# Altium project LCR_project.PrjPcb
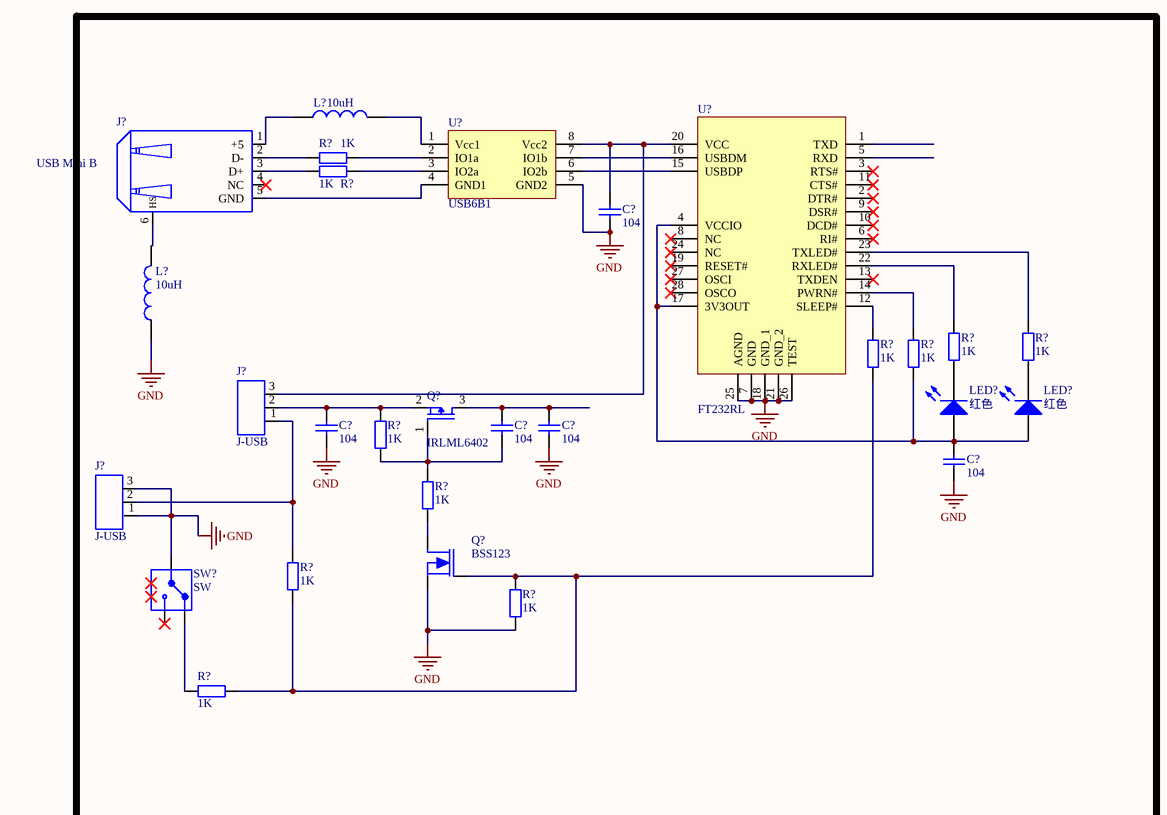
[diagram p0: 原理图.SchDoc, top left]
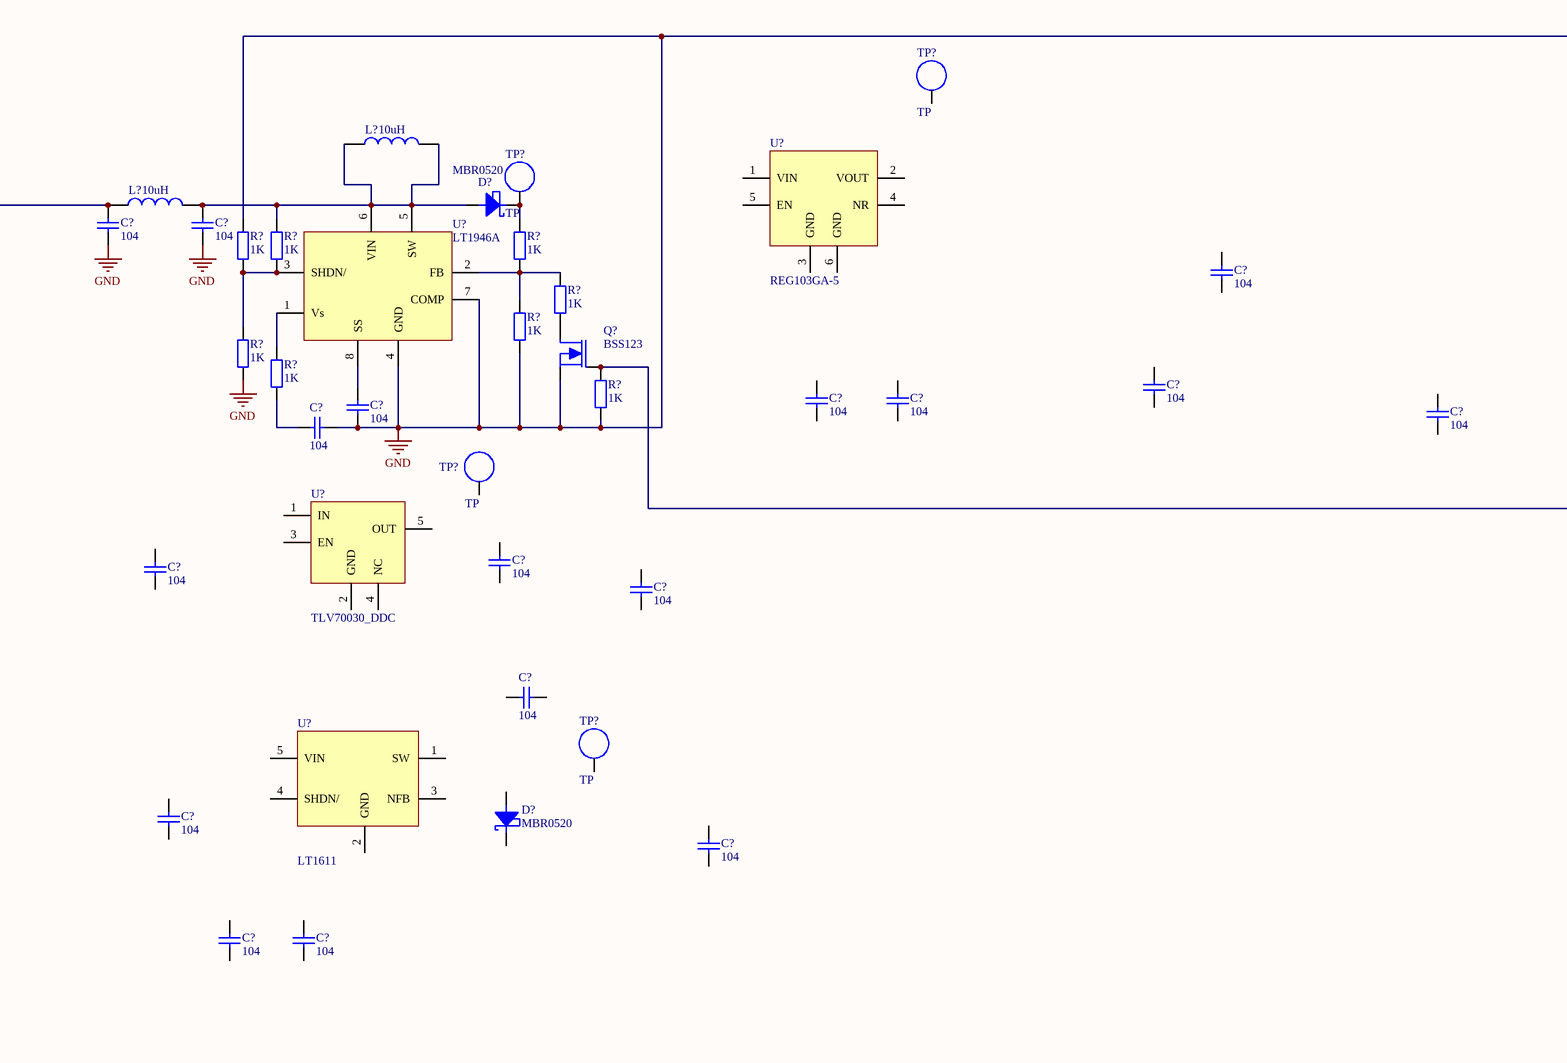
[diagram p1: 原理图.SchDoc, top middle]
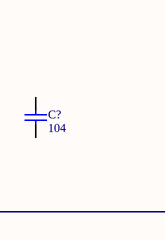
[diagram p2: 原理图.SchDoc, top right]
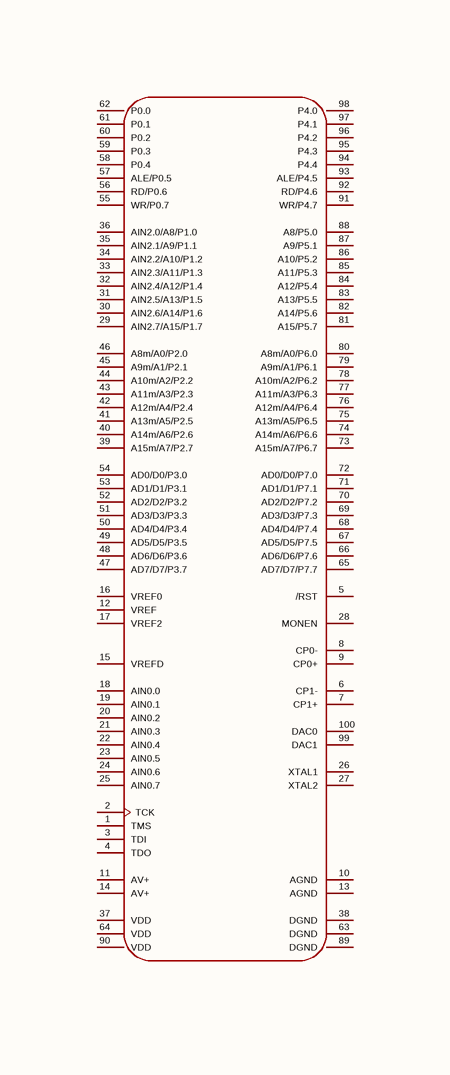
[diagram p3: 原理图.SchDoc, centre right]
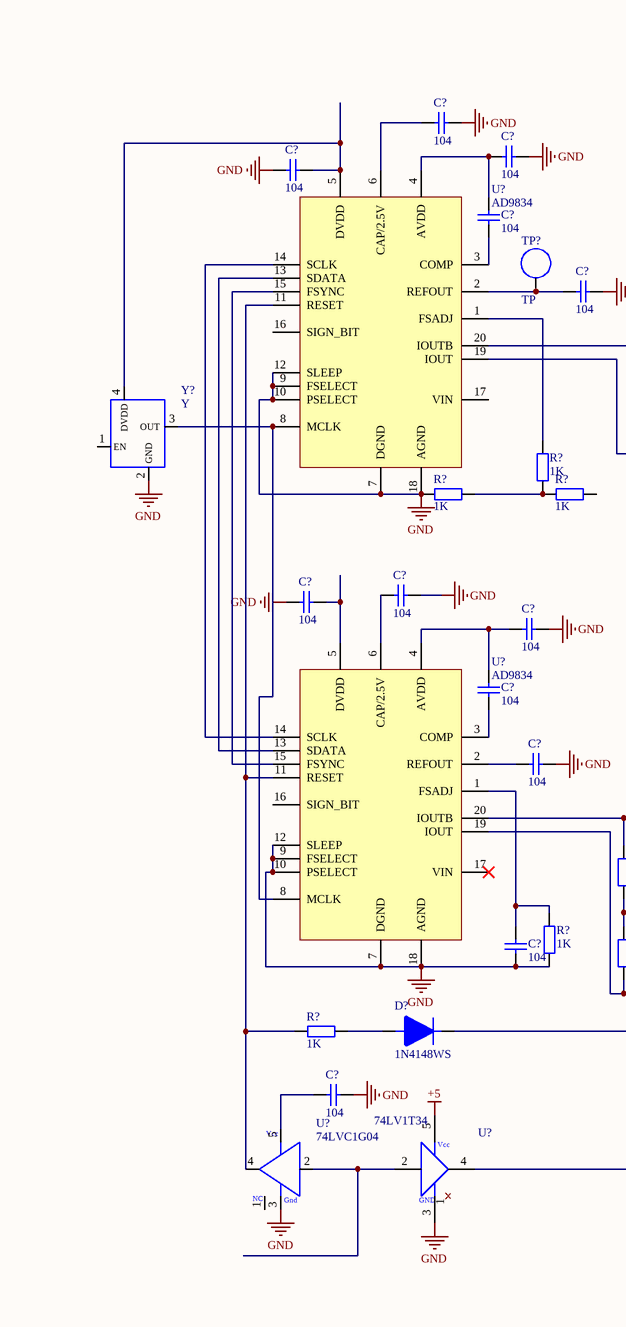
[diagram p4: 原理图.SchDoc, bottom left]
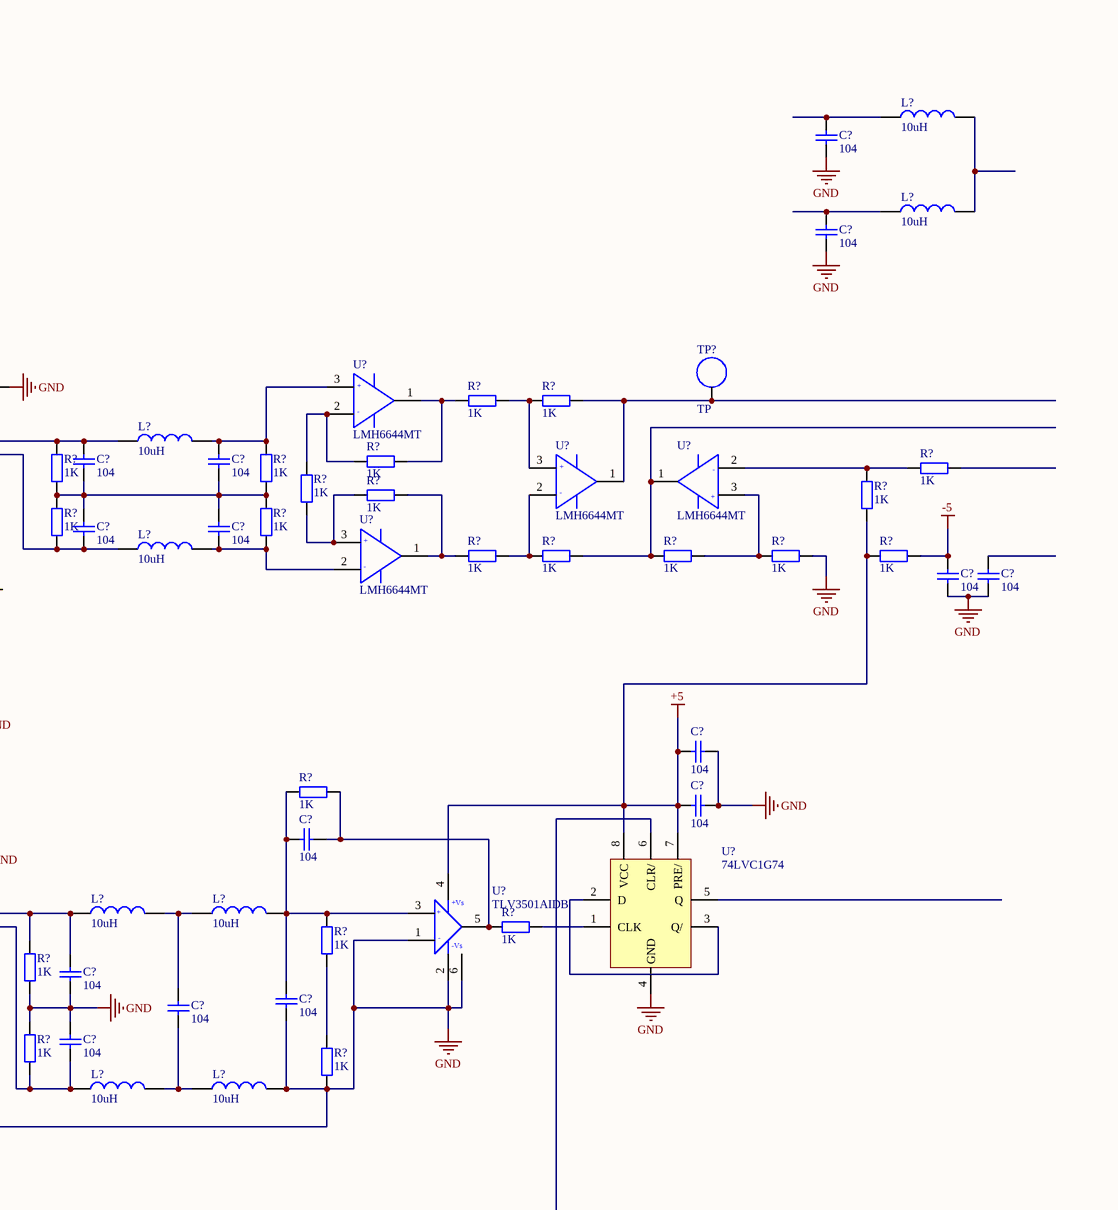
[diagram p5: 原理图.SchDoc, bottom middle]
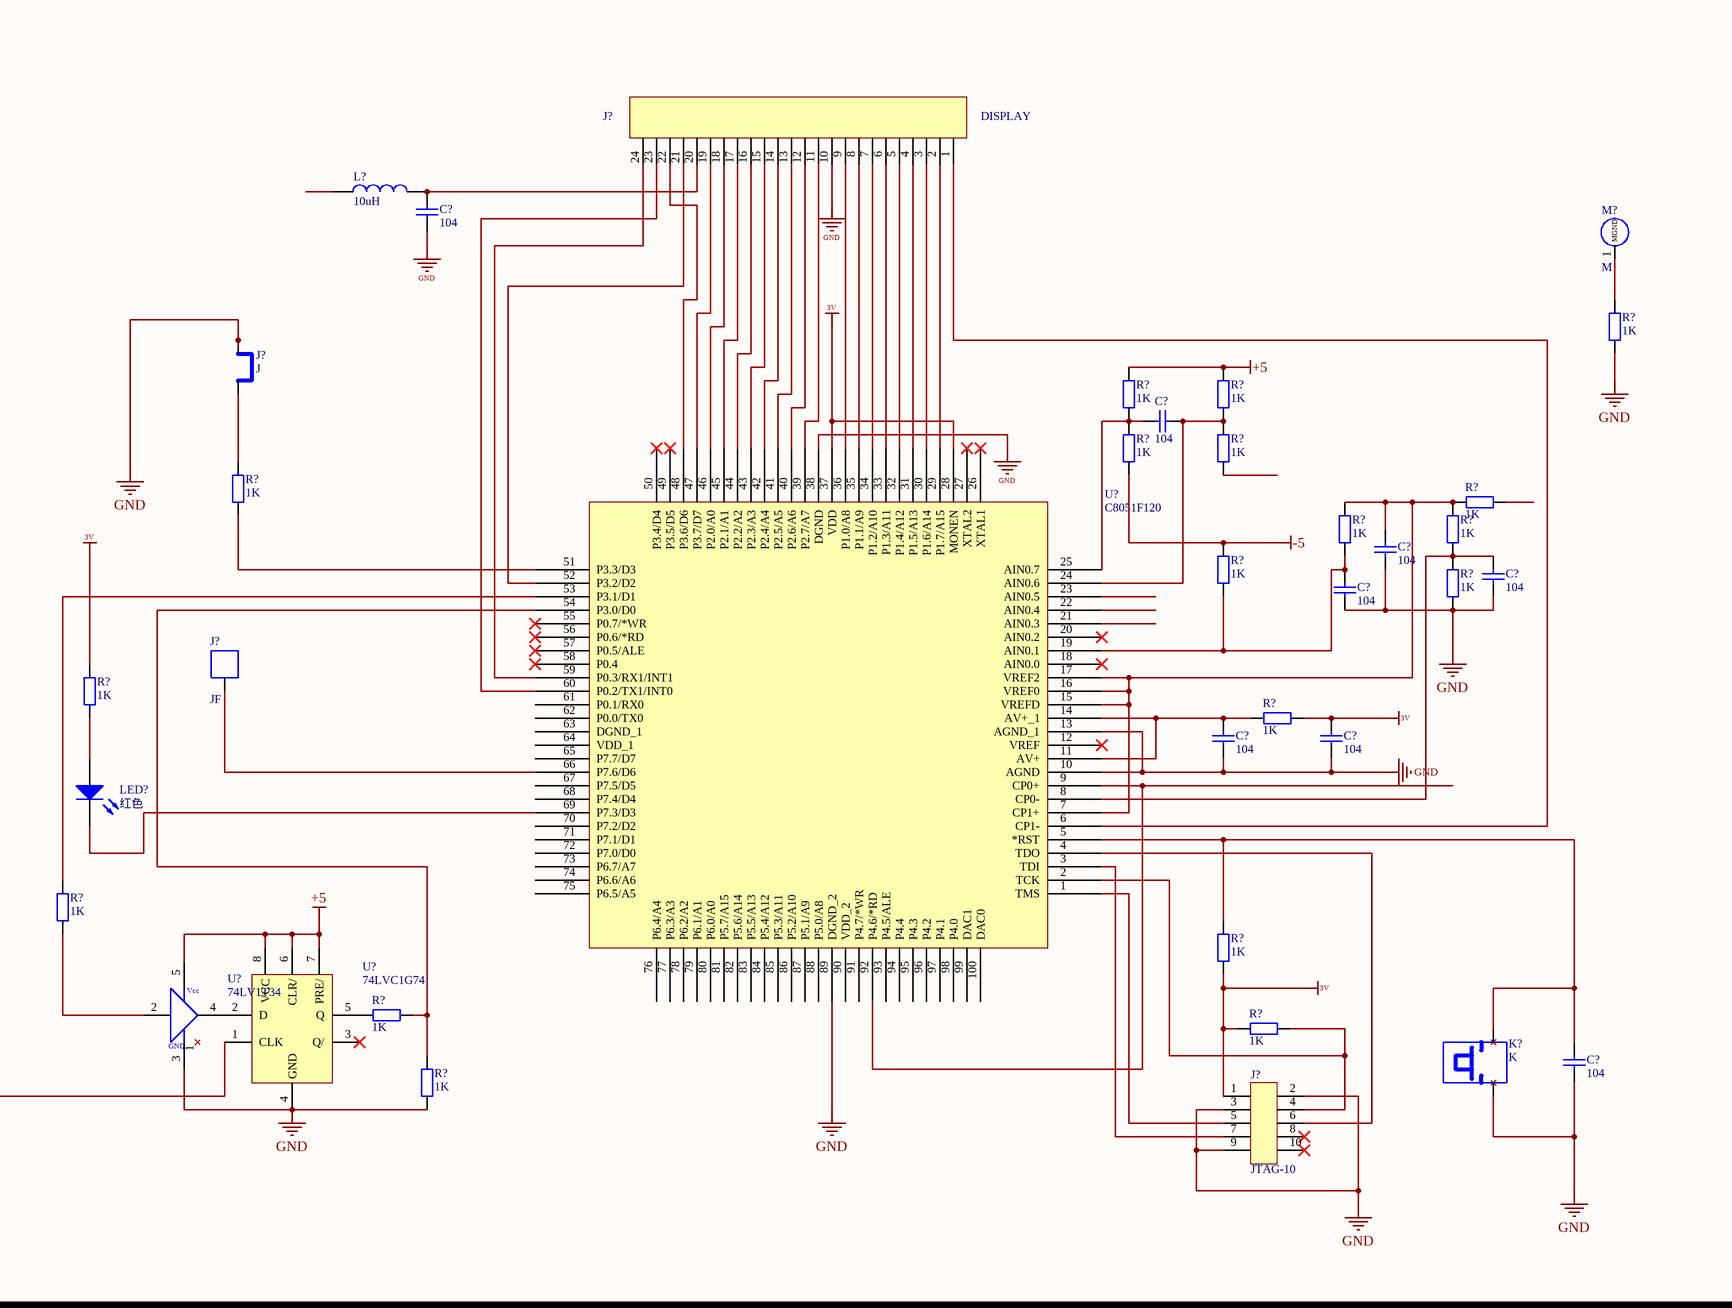
[diagram p6: 原理图.SchDoc, bottom right]
1 sheet, 181 parts. Net scope: global (net labels, ports and power ports of the same name join across sheets).
Board file: LCR_PCB.PcbDoc

## Sheet 原理图.SchDoc
size 1499 x 1499 mm

### Parts
(Parts that share a designator on the sheet are numbered #1, #2 ... from top to bottom, then left to right.)
C?#1  104  [C0603_L]
C?#2  104  [C0603_L]
C?#3  104  [C0603_L]
C?#4  104  [C0603_L]
C?#5  104  [C0603_L]
C?#6  104  [C0603_L]
C?#7  104  [C0603_L]
C?#8  104  [C0603_L]
C?#9  104  [C0603_L]
C?#10  104  [C0603_L]
C?#11  104  [C0603_L]
C?#12  104  [C0603_L]
C?#13  104  [C0603_L]
C?#14  104  [C0603_L]
C?#15  104  [C0603_L]
C?#16  104  [C0603_L]
C?#17  104  [C0603_L]
C?#18  104  [C0603_L]
C?#19  104  [C0603_L]
C?#20  104  [C0603_L]
C?#21  104  [C0603_L]
C?#22  104  [C0603_L]
C?#23  104  [C0603_L]
C?#24  104  [C0603_L]
C?#25  104  [C0603_L]
C?#26  104  [C0603_L]
C?#27  104  [C0603_L]
C?#28  104  [C0603_L]
C?#29  104  [C0603_L]
C?#30  104  [C0603_L]
C?#31  104  [C0603_L]
C?#32  104  [C0603_L]
C?#33  104  [C0603_L]
C?#34  104  [C0603_L]
C?#35  104  [C0603_L]
C?#36  104  [C0603_L]
C?#37  104  [C0603_L]
C?#38  104  [C0603_L]
C?#39  104  [C0603_L]
C?#40  104  [C0603_L]
C?#41  104  [C0603_L]
C?#42  104  [C0603_L]
C?#43  104  [C0603_L]
C?#44  104  [C0603_L]
C?#45  104  [C0603_L]
C?#46  104  [C0603_L]
C?#47  104  [C0603_L]
C?#48  104  [C0603_L]
C?#49  104  [C0603_L]
C?#50  104  [C0603_L]
C?#51  104  [C0603_L]
C?#52  104  [C0603_L]
C?#53  104  [C0603_L]
C?#54  104  [C0603_L]
C?#55  104  [C0603_L]
C?#56  104  [C0603_L]
C?#57  104  [C0603_L]
C?#58  104  [C0603_L]
D?#1  MBR0520
D?#2  MBR0520
D?#3  1N4148WS
J?#1  USB Mini B
J?#2  J-USB
J?#3  J-USB
J?#4  DISPLAY
J?#5  J
J?#6  JF
J?#7  JTAG-10
K?  K
L?#1  10uH  [L0603]
L?#2  10uH  [L0603]
L?#3  10uH  [L0603]
L?#4  10uH  [L0603]
L?#5  10uH  [L0603]
L?#6  10uH  [L0603]
L?#7  10uH  [L0603]
L?#8  10uH  [L0603]
L?#9  10uH  [L0603]
L?#10  10uH  [L0603]
L?#11  10uH  [L0603]
L?#12  10uH  [L0603]
L?#13  10uH  [L0603]
LED?#1  红色  [LED0805_G]
LED?#2  红色  [LED0805_G]
LED?#3  红色  [LED 8MM-B]
M?  M
Q?#1  BSS123
Q?#2  IRLML6402
Q?#3  BSS123
R?#1  1K  [R0603_L]
R?#2  1K  [R0603_L]
R?#3  1K  [R0603_L]
R?#4  1K  [R0603_L]
R?#5  1K  [R0603_L]
R?#6  1K  [R0603_L]
R?#7  1K  [R0603_L]
R?#8  1K  [R0603_L]
R?#9  1K  [R0603_L]
R?#10  1K  [R0603_L]
R?#11  1K  [R0603_L]
R?#12  1K  [R0603_L]
R?#13  1K  [R0603_L]
R?#14  1K  [R0603_L]
R?#15  1K  [R0603_L]
R?#16  1K  [R0603_L]
R?#17  1K  [R0603_L]
R?#18  1K  [R0603_L]
R?#19  1K  [R0603_L]
R?#20  1K  [R0603_L]
R?#21  1K  [R0603_L]
R?#22  1K  [R0603_L]
R?#23  1K  [R0603_L]
R?#24  1K  [R0603_L]
R?#25  1K  [R0603_L]
R?#26  1K  [R0603_L]
R?#27  1K  [R0603_L]
R?#28  1K  [R0603_L]
R?#29  1K  [R0603_L]
R?#30  1K  [R0603_L]
R?#31  1K  [R0603_L]
R?#32  1K  [R0603_L]
R?#33  1K  [R0603_L]
R?#34  1K  [R0603_L]
R?#35  1K  [R0603_L]
R?#36  1K  [R0603_L]
R?#37  1K  [R0603_L]
R?#38  1K  [R0603_L]
R?#39  1K  [R0603_L]
R?#40  1K  [R0603_L]
R?#41  1K  [R0603_L]
R?#42  1K  [R0603_L]
R?#43  1K  [R0603_L]
R?#44  1K  [R0603_L]
R?#45  1K  [R0603_L]
R?#46  1K  [R0603_L]
R?#47  1K  [R0603_L]
R?#48  1K  [R0603_L]
R?#49  1K  [R0603_L]
R?#50  1K  [R0603_L]
R?#51  1K  [R0603_L]
R?#52  1K  [R0603_L]
R?#53  1K  [R0603_L]
R?#54  1K  [R0603_L]
R?#55  1K  [R0603_L]
R?#56  1K  [R0603_L]
R?#57  1K  [R0603_L]
R?#58  1K  [R0603_L]
R?#59  1K  [R0603_L]
R?#60  1K  [R0603_L]
R?#61  1K  [R0603_L]
R?#62  1K  [R0603_L]
R?#63  1K  [R0603_L]
R?#64  1K  [R0603_L]
SW?  SW
TP?#1  TP
TP?#2  TP
TP?#3  TP
TP?#4  TP
TP?#5  TP
TP?#6  TP
U?#1  REG103GA-5
U?#2  LT1946A
U?#3  USB6B1
U?#4  FT232RL
U?#5  TLV70030_DDC
U?#6  LT1611
U?#7  C8051F120-GQR  (value not drawn)
U?#8  LMH6644MT
U?#9  C8051F120
U?#10  AD9834
U?#11  LMH6644MT
U?#12  LMH6644MT
U?#13  LMH6644MT
U?#14  74LVC1G74
U?#15  AD9834
U?#16  TLV3501AIDB
U?#17  74LVC1G74
U?#18  74LV1T34
U?#19  74LVC1G04
U?#20  74LV1T34
Y?  Y

### Nets
3V: C?#46.1 J?#7.1 R?#50.2 R?#51.1 R?#57.1 R?#61.2 U?#9.28(MONEN) U?#9.37(VDD)
+5: C?#47.1 C?#49.1 R?#23.2 R?#24.2 R?#26.2 R?#42.2 U?#14.7(PRE/) U?#14.8(VCC) U?#16.4 U?#17.6(CLR/) U?#17.7(PRE/) U?#17.8(VCC) U?#18.5 U?#20.5
-5: C?#39.2 R?#28.1 R?#42.1 R?#48.2
GND: C?#1.1 C?#2.1 C?#7.1 C?#10.1 C?#11.1 C?#16.1 C?#18.1 C?#19.1 C?#24.2 C?#25.2 C?#26.2 C?#27.2 C?#28.2 C?#29.1 C?#31.2 C?#37.2 C?#38.2 C?#39.1 C?#40.1 C?#41.2 C?#42.2 C?#43.1 C?#44.2 C?#45.2 C?#46.2 C?#47.2 C?#49.2 C?#51.2 C?#52.2 C?#53.2 C?#55.2 C?#56.1 C?#57.2 C?#58.2 D?#3.2 J?#3.1 J?#3.3 J?#4.10 J?#5.1 J?#7.2 J?#7.3 J?#7.9 K?.2 L?#4.1 L?#13.2 Q?#1.2 Q?#3.2 R?#1.1 R?#5.2 R?#6.2 R?#8.2 R?#18.2 R?#20.1 R?#41.1 R?#45.2 R?#49.1 R?#56.2 R?#58.2 R?#60.1 R?#62.2 R?#63.1 SW?.3 U?#2.4(GND) U?#2.7(COMP) U?#3.5(GND2) U?#4.7(GND) U?#4.18(GND_1) U?#4.21(GND_2) U?#4.25(AGND) U?#4.26(TEST) U?#9.10(AGND) U?#9.13(AGND_1) U?#9.38(DGND) U?#9.89(DGND_2) U?#10.7(DGND) U?#10.9(FSELECT) U?#10.10(PSELECT) U?#10.12(SLEEP) U?#10.18(AGND) U?#14.4(GND) U?#15.7(DGND) U?#15.9(FSELECT) U?#15.10(PSELECT) U?#15.12(SLEEP) U?#15.18(AGND) U?#16.1 U?#16.2 U?#16.6 U?#17.4(GND) U?#18.3 U?#19.3 U?#20.3 Y?.2(GND)
NetC?#1_2: C?#1.2 L?#2.1
NetC?#2_2: C?#2.2 D?#1.1 L?#1.1 L?#1.2 L?#2.2 R?#2.1 U?#2.5(SW) U?#2.6(VIN)
NetC?#7_2: C?#7.2 U?#2.8(SS)
NetC?#10_2: C?#10.2 R?#7.2
NetC?#11_2: C?#11.2 J?#2.3 U?#3.8(Vcc2) U?#4.20(VCC)
NetC?#16_2: C?#16.2 J?#2.2 Q?#2.2 R?#15.1
NetC?#17_1: C?#17.1 Q?#2.1 R?#15.2 R?#16.1
NetC?#17_2: C?#17.2 C?#18.2 Q?#2.3
NetC?#19_2: C?#19.2 LED?#1.1(A) LED?#2.1(A) R?#14.2 U?#4.4(VCCIO) U?#4.17(3V3OUT)
NetC?#24_1: C?#24.1 L?#5.1
NetC?#25_1: C?#25.1 J?#4.20 L?#6.2
NetC?#26_1: C?#26.1 U?#10.6(CAP/2.5V)
NetC?#27_1: C?#27.1 L?#7.1
NetC?#28_1: C?#28.1 C?#30.1 U?#10.4(AVDD)
NetC?#29_2: C?#29.2 U?#10.5(DVDD) Y?.4(DVDD)
NetC?#30_2: C?#30.2 U?#10.3(COMP)
NetC?#31_1: C?#31.1 TP?#5.1 U?#10.2(REFOUT)
NetC?#32_1: C?#32.1 R?#23.1 R?#28.2 U?#9.25(AIN0.7)
NetC?#32_2: C?#32.2 R?#24.1 R?#29.2 U?#9.24(AIN0.6)
NetC?#33_1: C?#33.1 L?#8.1 R?#30.2 U?#10.20(IOUTB)
NetC?#33_2: C?#33.2 C?#34.2 C?#35.1 C?#36.1 R?#30.1 R?#31.1 R?#36.2 R?#37.2
NetC?#34_1: C?#34.1 L?#8.2 R?#31.2 U?#8.3
NetC?#35_2: C?#35.2 L?#9.1 R?#36.1 U?#10.19(IOUT)
NetC?#36_2: C?#36.2 L?#9.2 R?#37.1 U?#13.2
NetC?#37_1: C?#37.1 R?#33.2 R?#43.2 R?#44.2 U?#9.7(CP1+) U?#9.15(VREFD) U?#9.16(VREF0) U?#9.17(VREF2)
NetC?#38_1: C?#38.1 R?#44.1 R?#49.2 U?#9.8(CP0-)
NetC?#41_1: C?#41.1 R?#43.1 R?#48.1 U?#9.19(AIN0.1)
NetC?#42_1: C?#42.1 U?#15.6(CAP/2.5V)
NetC?#43_2: C?#43.2 U?#15.5(DVDD)
NetC?#44_1: C?#44.1 C?#48.1 U?#15.4(AVDD)
NetC?#45_1: C?#45.1 R?#51.2 U?#9.11(AV+) U?#9.14(AV+_1)
NetC?#48_2: C?#48.2 U?#15.3(COMP)
NetC?#50_1: C?#50.1 C?#53.1 L?#11.2 R?#52.2 R?#53.1 U?#16.3
NetC?#50_2: C?#50.2 R?#52.1 R?#54.2 U?#16.5
NetC?#51_1: C?#51.1 U?#15.2(REFOUT)
NetC?#52_1: C?#52.1 L?#10.1 R?#56.1 U?#15.20(IOUTB)
NetC?#54_1: C?#54.1 L?#10.2 L?#11.1
NetC?#54_2: C?#54.2 L?#12.2 L?#13.1
NetC?#55_1: C?#55.1 R?#58.1 U?#15.1(FSADJ)
NetC?#56_2: C?#56.2 L?#12.1 R?#60.2 U?#15.19(IOUT)
NetC?#57_1: C?#57.1 K?.1 R?#57.2 U?#9.5(*RST)
NetC?#58_1: C?#58.1 U?#19.5
NetD?#1_2: D?#1.2 R?#3.1 TP?#2.1
NetD?#3_1: D?#3.1 R?#64.1
NetJ?#1_1: J?#1.1(+5) L?#3.1
NetJ?#1_2: J?#1.2(D-) R?#9.2
NetJ?#1_3: J?#1.3(D+) R?#10.2
NetJ?#1_5: J?#1.5(GND) U?#3.4(GND1)
NetJ?#1_6: J?#1.6(HS) L?#4.2
NetJ?#2_1: J?#2.1 J?#3.2 R?#17.1
NetJ?#4_1: J?#4.1 U?#9.6(CP1-)
NetJ?#4_2: J?#4.2 U?#9.29(P1.7/A15)
NetJ?#4_3: J?#4.3 U?#9.30(P1.6/A14)
NetJ?#4_4: J?#4.4 U?#9.31(P1.5/A13)
NetJ?#4_5: J?#4.5 U?#9.32(P1.4/A12)
NetJ?#4_6: J?#4.6 U?#9.33(P1.3/A11)
NetJ?#4_7: J?#4.7 U?#9.34(P1.2/A10)
NetJ?#4_8: J?#4.8 U?#9.35(P1.1/A9)
NetJ?#4_9: J?#4.9 U?#9.36(P1.0/A8)
NetJ?#4_11: J?#4.11 U?#9.39(P2.7/A7)
NetJ?#4_12: J?#4.12 U?#9.40(P2.6/A6)
NetJ?#4_13: J?#4.13 U?#9.41(P2.5/A5)
NetJ?#4_14: J?#4.14 U?#9.42(P2.4/A4)
NetJ?#4_15: J?#4.15 U?#9.43(P2.3/A3)
NetJ?#4_16: J?#4.16 U?#9.44(P2.2/A2)
NetJ?#4_17: J?#4.17 U?#9.45(P2.1/A1)
NetJ?#4_18: J?#4.18 U?#9.46(P2.0/A0)
NetJ?#4_19: J?#4.19 U?#9.47(P3.7/D7)
NetJ?#4_21: J?#4.21 U?#9.52(P3.2/D2)
NetJ?#4_22: J?#4.22 U?#9.48(P3.6/D6)
NetJ?#4_23: J?#4.23 U?#9.60(P0.2/TX1/INT0)
NetJ?#4_24: J?#4.24 U?#9.59(P0.3/RX1/INT1)
NetJ?#5_2: J?#5.2 R?#35.2
NetJ?#6_1: J?#6.1 U?#9.66(P7.6/D6)
NetJ?#7_4: J?#7.4 R?#61.1 U?#9.2(TCK)
NetJ?#7_5: J?#7.5 U?#9.1(TMS)
NetJ?#7_6: J?#7.6 U?#9.4(TDO)
NetJ?#7_7: J?#7.7 U?#9.3(TDI)
NetL?#3_2: L?#3.2 U?#3.1(Vcc1)
NetL?#5_2: L?#5.2 L?#7.2
NetLED?#1_2: LED?#1.2(K) R?#11.2
NetLED?#2_2: LED?#2.2(K) R?#12.2
NetLED?#3_1: LED?#3.1(A) R?#50.1
NetLED?#3_2: LED?#3.2(K) U?#9.69(P7.3/D3)
NetM?_1: M?.1(MGND) R?#20.2
NetQ?#1_1: Q?#1.1 R?#4.2
NetQ?#1_3: Q?#1.3 R?#8.1
NetQ?#3_1: Q?#3.1 R?#16.2
NetQ?#3_3: Q?#3.3 R?#13.2 R?#17.2 R?#18.1 R?#19.1
NetR?#1_2: R?#1.2 R?#2.2 R?#6.1 U?#2.3(SHDN/)
NetR?#3_2: R?#3.2 R?#4.1 R?#5.1 U?#2.2(FB)
NetR?#7_1: R?#7.1 U?#2.1(Vs)
NetR?#9_1: R?#9.1 U?#3.2(IO1a)
NetR?#10_1: R?#10.1 U?#3.3(IO2a)
NetR?#11_1: R?#11.1 U?#4.22(RXLED#)
NetR?#12_1: R?#12.1 U?#4.23(TXLED#)
NetR?#13_1: R?#13.1 U?#4.12(SLEEP#)
NetR?#14_1: R?#14.1 U?#4.14(PWRN#)
NetR?#19_2: R?#19.2 SW?.1
NetR?#21_1: R?#21.1 R?#22.2 U?#11.3
NetR?#21_2: R?#21.2 R?#25.1 U?#8.1
NetR?#22_1: R?#22.1 TP?#6.1 U?#11.1
NetR?#25_2: R?#25.2 R?#34.2 U?#8.2
NetR?#26_1: R?#26.1 R?#27.2 U?#12.2
NetR?#32_1: R?#32.1 R?#38.2 U?#13.1
NetR?#32_2: R?#32.2 R?#34.1 U?#13.3
NetR?#35_1: R?#35.1 U?#9.51(P3.3/D3)
NetR?#38_1: R?#38.1 R?#39.2 U?#11.2
NetR?#39_1: R?#39.1 R?#40.2 U?#12.1
NetR?#40_1: R?#40.1 R?#41.2 U?#12.3
NetR?#45_1: R?#45.1 R?#46.1 R?#47.2
NetR?#46_2: R?#46.2 U?#10.1(FSADJ)
NetR?#53_2: R?#53.2 R?#62.1
NetR?#54_1: R?#54.1 U?#14.1(CLK)
NetR?#55_1: R?#55.1 U?#18.2
NetR?#55_2: R?#55.2 U?#9.53(P3.1/D1)
NetR?#59_1: R?#59.1 R?#63.2 U?#9.54(P3.0/D0)
NetR?#59_2: R?#59.2 U?#17.5(Q)
NetR?#64_2: R?#64.2 U?#10.11(RESET) U?#15.11(RESET) U?#19.4
NetU?#3_6: U?#3.6(IO2b) U?#4.15(USBDP)
NetU?#3_7: U?#3.7(IO1b) U?#4.16(USBDM)
NetU?#9_9: U?#9.9(CP0+) U?#9.92(P4.6/*RD)
NetU?#10_8: U?#10.8(MCLK) U?#15.8(MCLK) Y?.3(OUT)
NetU?#10_13: U?#10.13(SDATA) U?#15.13(SDATA)
NetU?#10_14: U?#10.14(SCLK) U?#15.14(SCLK)
NetU?#10_15: U?#10.15(FSYNC) U?#15.15(FSYNC)
NetU?#14_2: U?#14.2(D) U?#14.3(Q/)
NetU?#14_6: U?#14.6(CLR/) U?#20.4
NetU?#17_2: U?#17.2(D) U?#18.4
NetU?#19_2: U?#19.2 U?#20.2

Not connected (* = marked no-connect by the designer): C?#3 1 2; C?#4 1 2; C?#5 1 2; C?#6 1 2; C?#8 1 2; C?#9 1 2; C?#12 1 2; C?#13 1 2; C?#14 1 2; C?#15 1 2; C?#20 1 2; C?#21 1 2; C?#22 1 2; C?#23 1 2; C?#40 2; D?#2 1 2; J?#1 4(NC)*; J?#7 8* 10*; L?#6 1; R?#27 1; R?#29 1; R?#33 1; R?#47 1; SW? 0* 2*; TP?#1 1; TP?#3 1; TP?#4 1; U?#1 1(VIN) 2(VOUT) 3(GND) 4(NR) 5(EN) 6(GND); U?#4 1(TXD) 2(DTR#)* 3(RTS#)* 5(RXD) 6(RI#)* 8(NC)* 9(DSR#)* 10(DCD#)* 11(CTS#)* 13(TXDEN)* 19(RESET#)* 24(NC)* 27(OSCI)* 28(OSCO)*; U?#5 1(IN) 2(GND) 3(EN) 4(NC) 5(OUT); U?#6 1(SW) 2(GND) 3(NFB) 4(SHDN/) 5(VIN); U?#7 1(TMS) 2(TCK) 3(TDI) 4(TDO) 5(/RST) 6(CP1-) 7(CP1+) 8(CP0-) 9(CP0+) 10(AGND) 11(AV+) 12(VREF) 13(AGND) 14(AV+) 15(VREFD) 16(VREF0) 17(VREF2) 18(AIN0.0) 19(AIN0.1) 20(AIN0.2) 21(AIN0.3) 22(AIN0.4) 23(AIN0.5) 24(AIN0.6) 25(AIN0.7) 26(XTAL1) 27(XTAL2) 28(MONEN) 29(AIN2.7/A15/P1.7) 30(AIN2.6/A14/P1.6) 31(AIN2.5/A13/P1.5) 32(AIN2.4/A12/P1.4) 33(AIN2.3/A11/P1.3) 34(AIN2.2/A10/P1.2) 35(AIN2.1/A9/P1.1) 36(AIN2.0/A8/P1.0) 37(VDD) 38(DGND) 39(A15m/A7/P2.7) 40(A14m/A6/P2.6) 41(A13m/A5/P2.5) 42(A12m/A4/P2.4) 43(A11m/A3/P2.3) 44(A10m/A2/P2.2) 45(A9m/A1/P2.1) 46(A8m/A0/P2.0) 47(AD7/D7/P3.7) 48(AD6/D6/P3.6) 49(AD5/D5/P3.5) 50(AD4/D4/P3.4) 51(AD3/D3/P3.3) 52(AD2/D2/P3.2) 53(AD1/D1/P3.1) 54(AD0/D0/P3.0) 55(WR/P0.7) 56(RD/P0.6) 57(ALE/P0.5) 58(P0.4) 59(P0.3) 60(P0.2) 61(P0.1) 62(P0.0) 63(DGND) 64(VDD) 65(AD7/D7/P7.7) 66(AD6/D6/P7.6) 67(AD5/D5/P7.5) 68(AD4/D4/P7.4) 69(AD3/D3/P7.3) 70(AD2/D2/P7.2) 71(AD1/D1/P7.1) 72(AD0/D0/P7.0) 73(A15m/A7/P6.7) 74(A14m/A6/P6.6) 75(A13m/A5/P6.5) 76(A12m/A4/P6.4) 77(A11m/A3/P6.3) 78(A10m/A2/P6.2) 79(A9m/A1/P6.1) 80(A8m/A0/P6.0) 81(A15/P5.7) 82(A14/P5.6) 83(A13/P5.5) 84(A12/P5.4) 85(A11/P5.3) 86(A10/P5.2) 87(A9/P5.1) 88(A8/P5.0) 89(DGND) 90(VDD) 91(WR/P4.7) 92(RD/P4.6) 93(ALE/P4.5) 94(P4.4) 95(P4.3) 96(P4.2) 97(P4.1) 98(P4.0) 99(DAC1) 100(DAC0); U?#9 12(VREF)* 18(AIN0.0)* 20(AIN0.2)* 21(AIN0.3) 22(AIN0.4) 23(AIN0.5) 26(XTAL1)* 27(XTAL2)* 49(P3.5/D5)* 50(P3.4/D4)* 55(P0.7/*WR)* 56(P0.6/*RD)* 57(P0.5/ALE)* 58(P0.4)* 61(P0.1/RX0) 62(P0.0/TX0) 63(DGND_1) 64(VDD_1) 65(P7.7/D7) 67(P7.5/D5) 68(P7.4/D4) 70(P7.2/D2) 71(P7.1/D1) 72(P7.0/D0) 73(P6.7/A7) 74(P6.6/A6) 75(P6.5/A5) 76(P6.4/A4) 77(P6.3/A3) 78(P6.2/A2) 79(P6.1/A1) 80(P6.0/A0) 81(P5.7/A15) 82(P5.6/A14) 83(P5.5/A13) 84(P5.4/A12) 85(P5.3/A11) 86(P5.2/A10) 87(P5.1/A9) 88(P5.0/A8) 90(VDD_2) 91(P4.7/*WR) 93(P4.5/ALE) 94(P4.4) 95(P4.3) 96(P4.2) 97(P4.1) 98(P4.0) 99(DAC1) 100(DAC0); U?#10 16(SIGN_BIT) 17(VIN); U?#14 5(Q); U?#15 16(SIGN_BIT) 17(VIN)*; U?#17 1(CLK) 3(Q/)*; U?#18 1; U?#19 1; U?#20 1; Y? 1(EN)

### Notes on the sheet
- Title
- Size:
- Date:
- File:
- A0
- Number:
- Time:
- Revision:
- Sheet
- of
- (in symbol 74LV1T34) Vcc; GND
- (in symbol 74LVC1G04) Vcc; NC; Gnd
- (in symbol LMH6644MT) +; -
- (in symbol TLV3501AIDB) +Vs; +; -; -Vs

### Library data of the parts
C?#1-C?#58 = C: 贴片电容/MLCC电容; BOM名称: 无极性贴片电容; 当前库版本V2022.12.25 @淘宝卖家:黄晶宝石: 最新版本发布https://shop463601444.taobao.com
J?#1 = USB Mini B: USB接口
J?#5 = J: 连接线  J
K? = K: RESET按键
L?#1-L?#13 = L: 贴片小功率电感; BOM名称: 小功率贴片电感; 联系下单店铺卖家 免费帮你查找封装: 联系下单店铺卖家 免费技术支持
LED?#1 LED?#2 = LED: 贴片LED; 封装库来自淘宝卖家：黄晶宝石: 其他店铺购入均为盗版封装库，无更新权益，请立即申请退款，本店现金奖励200~1000元; BOM名称: 贴片LED
LED?#3 = LED-8MM: 直插8mm LED; BOM名称: 8mm插件LED; 封装库来自淘宝卖家：黄晶宝石: 其他店铺购入均为盗版封装库，无更新权益，请立即申请退款，本店现金奖励200~1000元
R?#1-R?#64 = R: 贴片电阻; 联系下单店铺卖家 免费帮你查找封装: 联系下单店铺卖家 免费技术支持; BOM名称: 贴片电阻
U?#9 = C8051F120: CPU
U?#7 = C8051F120-GQR: Symbol: C8051F120-GQR